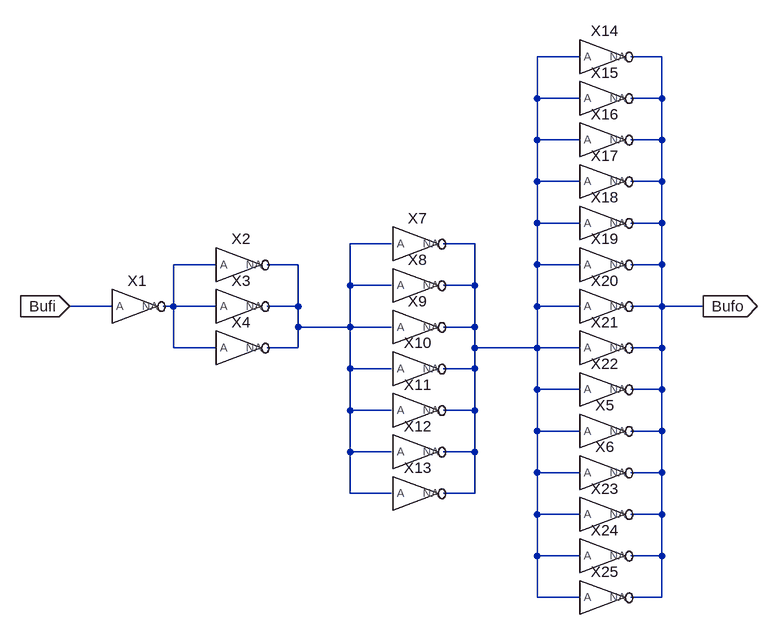
[diagram p0: schematic Buffer2x.asc]
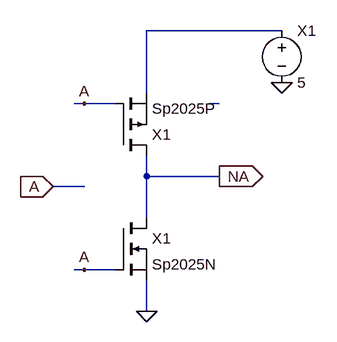
[diagram p1: sub-circuit invert.asc]
Buffer2x.asc, the LTspice schematic file:
Version 4.1.1
SHEET 1 1328 680
WIRE 784 -256 720 -256
WIRE 912 -256 864 -256
WIRE 720 -192 720 -256
WIRE 784 -192 720 -192
WIRE 912 -192 912 -256
WIRE 912 -192 864 -192
WIRE 720 -128 720 -192
WIRE 784 -128 720 -128
WIRE 912 -128 912 -192
WIRE 912 -128 864 -128
WIRE 720 -64 720 -128
WIRE 784 -64 720 -64
WIRE 912 -64 912 -128
WIRE 912 -64 864 -64
WIRE 720 0 720 -64
WIRE 784 0 720 0
WIRE 912 0 912 -64
WIRE 912 0 864 0
WIRE 496 32 432 32
WIRE 624 32 576 32
WIRE 224 64 160 64
WIRE 352 64 304 64
WIRE 720 64 720 0
WIRE 784 64 720 64
WIRE 912 64 912 0
WIRE 912 64 864 64
WIRE 432 96 432 32
WIRE 496 96 432 96
WIRE 624 96 624 32
WIRE 624 96 576 96
WIRE 64 128 0 128
WIRE 160 128 160 64
WIRE 160 128 144 128
WIRE 224 128 160 128
WIRE 352 128 352 64
WIRE 352 128 304 128
WIRE 720 128 720 64
WIRE 784 128 720 128
WIRE 912 128 912 64
WIRE 912 128 864 128
WIRE 976 128 912 128
WIRE 352 160 352 128
WIRE 432 160 432 96
WIRE 432 160 352 160
WIRE 496 160 432 160
WIRE 624 160 624 96
WIRE 624 160 576 160
WIRE 160 192 160 128
WIRE 224 192 160 192
WIRE 352 192 352 160
WIRE 352 192 304 192
WIRE 624 192 624 160
WIRE 720 192 720 128
WIRE 720 192 624 192
WIRE 784 192 720 192
WIRE 912 192 912 128
WIRE 912 192 864 192
WIRE 432 224 432 160
WIRE 496 224 432 224
WIRE 624 224 624 192
WIRE 624 224 576 224
WIRE 720 256 720 192
WIRE 784 256 720 256
WIRE 912 256 912 192
WIRE 912 256 864 256
WIRE 432 288 432 224
WIRE 496 288 432 288
WIRE 624 288 624 224
WIRE 624 288 576 288
WIRE 720 320 720 256
WIRE 784 320 720 320
WIRE 912 320 912 256
WIRE 912 320 864 320
WIRE 432 352 432 288
WIRE 496 352 432 352
WIRE 624 352 624 288
WIRE 624 352 576 352
WIRE 720 384 720 320
WIRE 784 384 720 384
WIRE 912 384 912 320
WIRE 912 384 864 384
WIRE 432 416 432 352
WIRE 496 416 432 416
WIRE 624 416 624 352
WIRE 624 416 576 416
WIRE 720 448 720 384
WIRE 784 448 720 448
WIRE 912 448 912 384
WIRE 912 448 864 448
WIRE 720 512 720 448
WIRE 784 512 720 512
WIRE 912 512 912 448
WIRE 912 512 864 512
WIRE 720 576 720 512
WIRE 784 576 720 576
WIRE 912 576 912 512
WIRE 912 576 864 576
FLAG 0 128 Bufi
IOPIN 0 128 In
FLAG 976 128 Bufo
IOPIN 976 128 Out
SYMBOL INVERT 96 128 R0
SYMATTR InstName X1
SYMBOL INVERT 256 64 R0
SYMATTR InstName X2
SYMBOL INVERT 256 128 R0
SYMATTR InstName X3
SYMBOL INVERT 256 192 R0
SYMATTR InstName X4
SYMBOL INVERT 528 32 R0
SYMATTR InstName X7
SYMBOL INVERT 528 96 R0
SYMATTR InstName X8
SYMBOL INVERT 528 160 R0
SYMATTR InstName X9
SYMBOL INVERT 528 224 R0
SYMATTR InstName X10
SYMBOL INVERT 528 288 R0
SYMATTR InstName X11
SYMBOL INVERT 528 352 R0
SYMATTR InstName X12
SYMBOL INVERT 528 416 R0
SYMATTR InstName X13
SYMBOL INVERT 816 -256 R0
SYMATTR InstName X14
SYMBOL INVERT 816 -192 R0
SYMATTR InstName X15
SYMBOL INVERT 816 -128 R0
SYMATTR InstName X16
SYMBOL INVERT 816 -64 R0
SYMATTR InstName X17
SYMBOL INVERT 816 0 R0
SYMATTR InstName X18
SYMBOL INVERT 816 64 R0
SYMATTR InstName X19
SYMBOL INVERT 816 128 R0
SYMATTR InstName X20
SYMBOL INVERT 816 192 R0
SYMATTR InstName X21
SYMBOL INVERT 816 256 R0
SYMATTR InstName X22
SYMBOL INVERT 816 320 R0
SYMATTR InstName X5
SYMBOL INVERT 816 384 R0
SYMATTR InstName X6
SYMBOL INVERT 816 448 R0
SYMATTR InstName X23
SYMBOL INVERT 816 512 R0
SYMATTR InstName X24
SYMBOL INVERT 816 576 R0
SYMATTR InstName X25

invert.asc, the sub-circuit schematic file:
Version 4
SHEET 1 880 680
WIRE 352 -80 144 -80
WIRE 144 16 144 -80
WIRE 48 32 32 32
WIRE 96 32 48 32
WIRE 256 32 240 32
WIRE 144 144 144 112
WIRE 256 144 144 144
WIRE 48 160 0 160
WIRE 144 208 144 144
WIRE 48 288 32 288
WIRE 96 288 48 288
WIRE 144 352 144 304
FLAG 144 352 0
FLAG 0 160 A
IOPIN 0 160 In
FLAG 48 288 A
FLAG 48 32 A
FLAG 256 144 NA
IOPIN 256 144 Out
FLAG 352 0 0
SYMBOL pmos 96 112 M180
SYMATTR InstName X1
SYMATTR Value Sp2025P
SYMBOL nmos 96 208 R0
SYMATTR InstName X1
SYMATTR Value Sp2025N
SYMBOL voltage 352 -96 R0
SYMATTR InstName X1
SYMATTR Value 5

The netlist it stands for:
* Buffer2x.asc
XX1 Bufi N003 invert
XX2 N003 N002 invert
XX3 N003 N002 invert
XX4 N003 N002 invert
XX7 N002 N001 invert
XX8 N002 N001 invert
XX9 N002 N001 invert
XX10 N002 N001 invert
XX11 N002 N001 invert
XX12 N002 N001 invert
XX13 N002 N001 invert
XX14 N001 Bufo invert
XX15 N001 Bufo invert
XX16 N001 Bufo invert
XX17 N001 Bufo invert
XX18 N001 Bufo invert
XX19 N001 Bufo invert
XX20 N001 Bufo invert
XX21 N001 Bufo invert
XX22 N001 Bufo invert
XX5 N001 Bufo invert
XX6 N001 Bufo invert
XX23 N001 Bufo invert
XX24 N001 Bufo invert
XX25 N001 Bufo invert

* block symbol definitions
.subckt invert A NA
M§X1 NA A N001 N001 Sp2025P
M§X1 NA A 0 0 Sp2025N
V§X1 N001 0 5
.ends invert

.model NMOS NMOS
.model PMOS PMOS
.lib standard.mos
.backanno
.end